# EAGLE schematic alt_rpd_schematic (EAGLE 9.7.0)
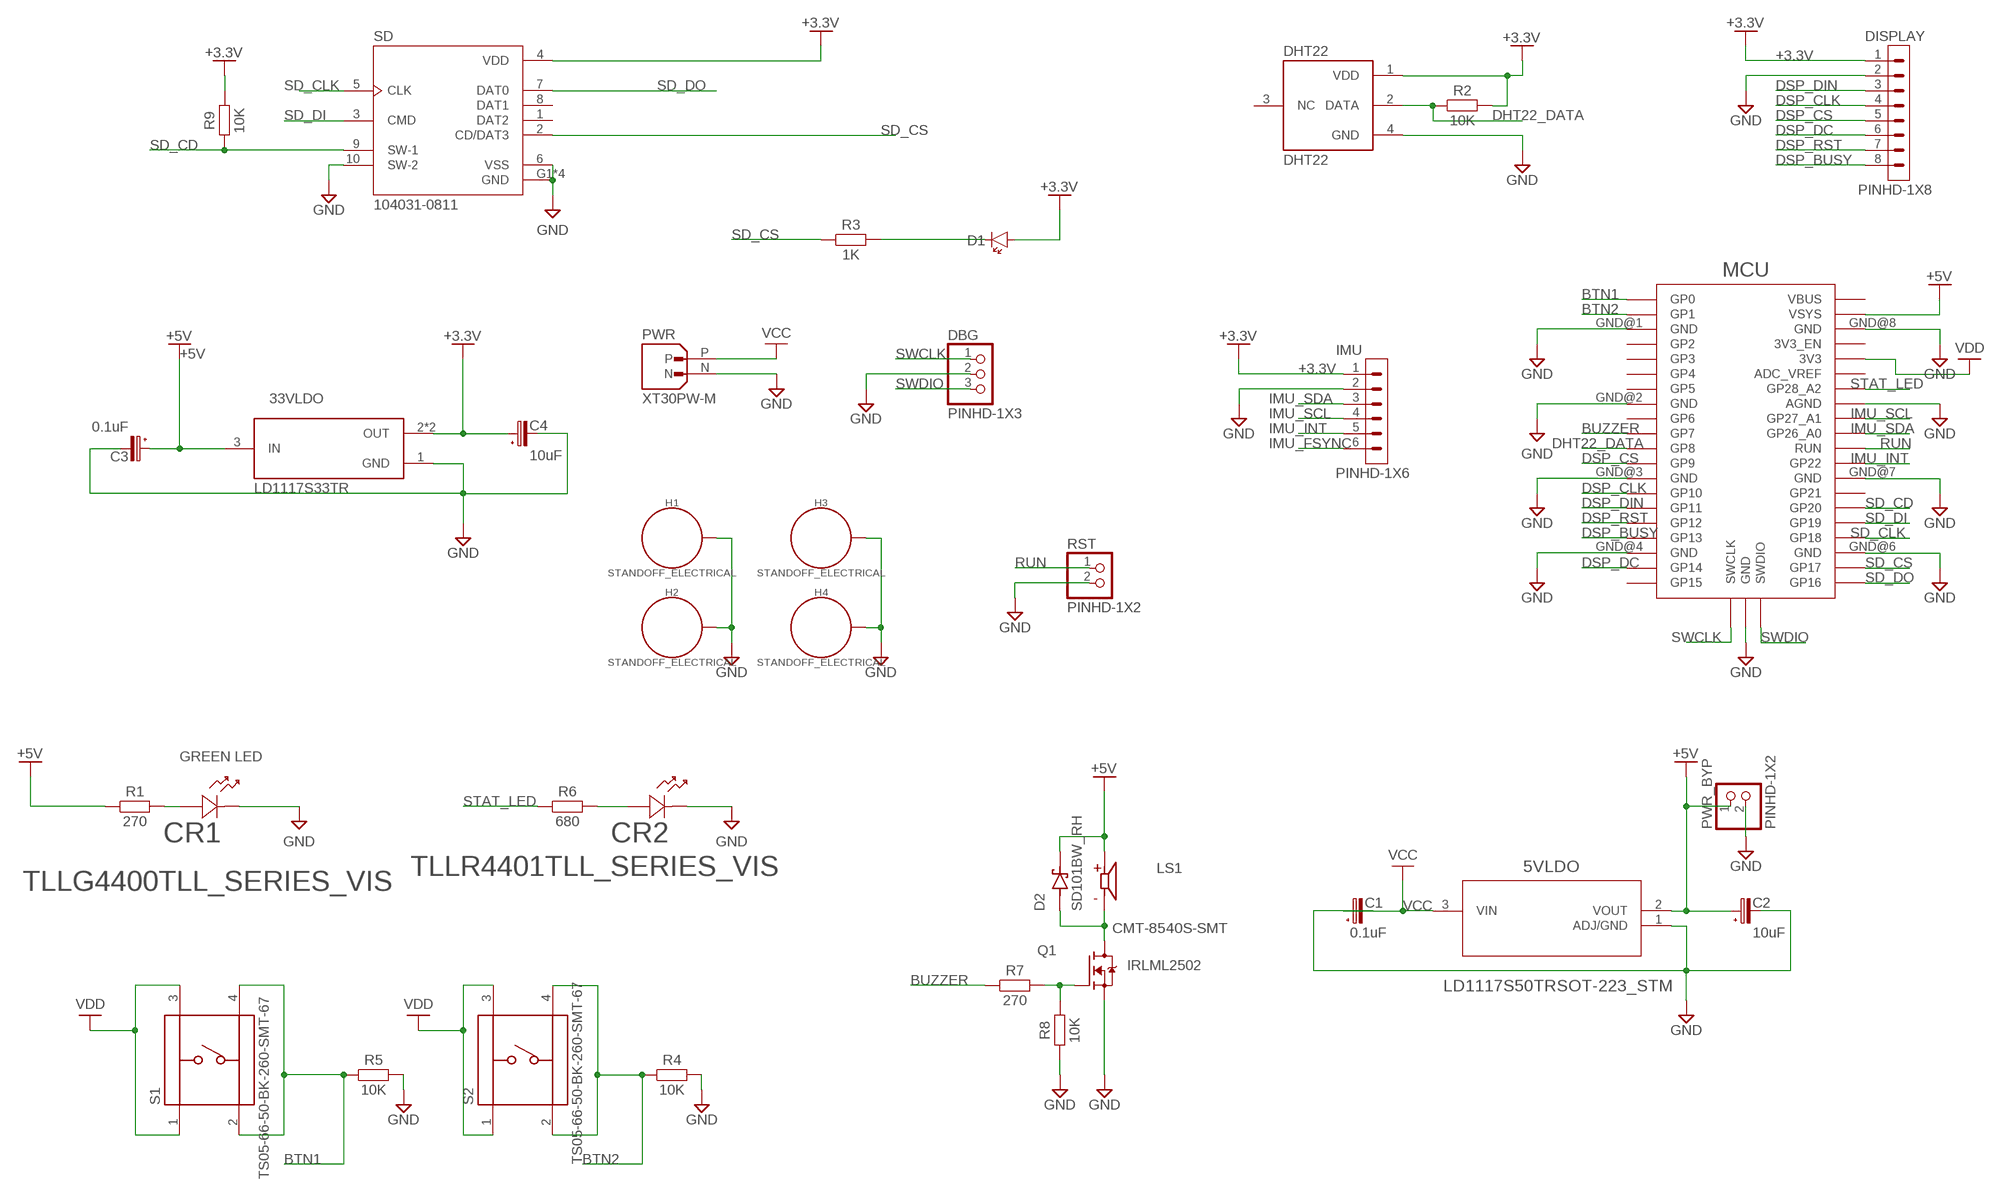
[diagram p0: schematic, sheet 1]

## Parts
5VLDO  LD1117S50TRSOT-223_STM  [SOT-223_STM]
33VLDO  LD1117S33TR  [SOT230P700X180-4N]
C1  0.1uF  C-POL_TANTALUM-1206(3216-METRIC)  [CAPMP3216X180N]
C2  10uF  C-POL_TANTALUM-1206(3216-METRIC)  [CAPMP3216X180N]
C3  0.1uF  C-POL_TANTALUM-1206(3216-METRIC)  [CAPMP3216X180N]
C4  10uF  C-POL_TANTALUM-1206(3216-METRIC)  [CAPMP3216X180N]
CR1  TLLG4400TLL_SERIES_VIS  [TLL_SERIES_VIS]
CR2  TLLR4401TLL_SERIES_VIS  [TLL_SERIES_VIS]
D1  LED_RED  CHIP-FLAT-R_0805  [LEDC2012X110N_FLAT-R]
D2  SD101BW_RH  [DIO_SD101BW_RH]
DBG  PINHD-1X3  [1X03]
DHT22  DHT22  [XDCR_DHT22]
DISPLAY  PINHD-1X8  [1X08]
H1  STANDOFF_ELECTRICAL  [STANDOFF-ELECTRICAL]
H2  STANDOFF_ELECTRICAL  [STANDOFF-ELECTRICAL]
H3  STANDOFF_ELECTRICAL  [STANDOFF-ELECTRICAL]
H4  STANDOFF_ELECTRICAL  [STANDOFF-ELECTRICAL]
IMU  PINHD-1X6  [1X06]
LS1  CMT-8540S-SMT  [CUI_CMT-8540S-SMT]
MCU  RPI_PICO_IG-SMD  [RPI_PICO]
PWR  XT30PW-M  [AMASS_XT30PW-M]
PWR_BYP  PINHD-1X2  [1X02]
Q1  IRLML2502  [SOT95P237X112-3N]
R1  270  R_CHIP-1210(3225-METRIC)  [RESC3224X71]
R2  10K  R_CHIP-1206(3216-METRIC)  [RESC3216X70]
R3  1K  R_CHIP-1206(3216-METRIC)  [RESC3216X70]
R4  10K  R_CHIP-1206(3216-METRIC)  [RESC3216X70]
R5  10K  R_CHIP-1206(3216-METRIC)  [RESC3216X70]
R6  680  R_CHIP-1210(3225-METRIC)  [RESC3224X71]
R7  270  R_CHIP-1210(3225-METRIC)  [RESC3224X71]
R8  10K  R_CHIP-1206(3216-METRIC)  [RESC3216X70]
R9  10K  R_CHIP-1206(3216-METRIC)  [RESC3216X70]
RST  PINHD-1X2  [1X02]
S1  TS05-66-50-BK-260-SMT-67  [SW_TS05-66-50-BK-260-SMT-67]
S2  TS05-66-50-BK-260-SMT-67  [SW_TS05-66-50-BK-260-SMT-67]
SD  104031-0811  [MOLEX_104031-0811]

## Nets
+3.3V [Power]: 33VLDO.2(OUT) 33VLDO.4(OUT) C4.1(+) D1.A DHT22.1(VDD) DISPLAY.1 IMU.1 R2.2 R9.2 SD.4(VDD)
+5V [Power]: 5VLDO.2(VOUT) 33VLDO.3(IN) C2.1(+) C3.1(+) D2.C(K) LS1.P MCU.VSYS PWR_BYP.1 R1.1
BTN1: MCU.GP0 R5.1 S1.2 S1.4
BTN2: MCU.GP1 R4.1 S2.2 S2.4
BUZZER: MCU.GP7 R7.1
DHT22_DATA: DHT22.2(DATA) MCU.GP8 R2.1
DSP_BUSY: DISPLAY.8 MCU.GP13
DSP_CLK: DISPLAY.4 MCU.GP10
DSP_CS: DISPLAY.5 MCU.GP9
DSP_DC: DISPLAY.6 MCU.GP14
DSP_DIN: DISPLAY.3 MCU.GP11
DSP_RST: DISPLAY.7 MCU.GP12
GND [Power]: 5VLDO.1(ADJ/GND) 33VLDO.1(GND) C1.2(-) C2.2(-) C3.2(-) C4.2(-) CR1.1 CR2.1 DBG.2 DHT22.4(GND) DISPLAY.2 H1.P1 H2.P1 H3.P1 H4.P1 IMU.2 MCU.AGND MCU.GND@1(GND) MCU.GND@2(GND) MCU.GND@3(GND) MCU.GND@4(GND) MCU.GND@5(GND) MCU.GND@6(GND) MCU.GND@7(GND) MCU.GND@8(GND) PWR.N PWR_BYP.2 Q1.2(S) R4.2 R5.2 R8.1 RST.2 SD.6(VSS) SD.10(SW-2) SD.G1(GND) SD.G2(GND) SD.G3(GND) SD.G4(GND)
IMU_FSYNC: IMU.6
IMU_INT: IMU.5 MCU.GP22
IMU_SCL: IMU.4 MCU.GP27_A1
IMU_SDA: IMU.3 MCU.GP26_A0
N$1: CR2.2 R6.2
N$2: CR1.2 R1.2
N$3: D2.A LS1.N Q1.3(D)
N$4: Q1.1(G) R7.2 R8.2
N$7: D1.C R3.2
RUN: MCU.RUN RST.1
SD_CD: MCU.GP20 R9.1 SD.9(SW-1)
SD_CLK: MCU.GP18 SD.5(CLK)
SD_CS: MCU.GP17 R3.1 SD.2(CD/DAT3)
SD_DI: MCU.GP19 SD.3(CMD)
SD_DO: MCU.GP16 SD.7(DAT0)
STAT_LED: MCU.GP28_A2 R6.1
SWCLK: DBG.1 MCU.SWCLK
SWDIO: DBG.3 MCU.SWDIO
VCC [Power]: 5VLDO.3(VIN) C1.1(+) PWR.P
VDD [Power]: MCU.3V3 S1.1 S1.3 S2.1 S2.3
Unconnected: DHT22.3(NC) MCU.3V3_EN MCU.ADC_VREF MCU.GP2 MCU.GP3 MCU.GP4 MCU.GP5 MCU.GP6 MCU.GP15 MCU.GP21 MCU.VBUS SD.1(DAT2) SD.8(DAT1)

## Library data of the parts
5VLDO = ukseds electronics:LD1117S50TR; COPYRIGHT: Copyright (C) 2026 Ultra Librarian. All rights reserved.; DATASHEET: https://www.st.com/resource/en/datasheet/ld1117.pdf; DESCRIPTION: Adjustable and fixed low drop positive voltage regulator; MANUFACTURER_NAME: STMicroelectronics; MANUFACTURER_PART_NUMBER: LD1117S50TR
33VLDO = ukseds electronics:LD1117S33TR; MANUFACTURER: ST Microelectronics
C1-C4 = Capacitor:C-POL: Capacitor Polarised - Generic; CATEGORY: Capacitor; PACKAGE_SIZE: 1206; PACKAGE_TYPE: Surface Mount; SUBCATEGORY: Tantalum Capacitors; TYPE: Polymer Capacitors
CR1 = ukseds electronics:TLLG4400; COPYRIGHT: Copyright (C) 2026 Ultra Librarian. All rights reserved.; DATASHEET: https://www.vishay.com/doc?83029; DESCRIPTION: GREEN LED; MANUFACTURER_NAME: Vishay; MANUFACTURER_PART_NUMBER: TLLG4400
CR2 = ukseds electronics:TLLR4401; COPYRIGHT: Copyright (C) 2026 Ultra Librarian. All rights reserved.; DATASHEET: https://www.vishay.com/doc?83029; DESCRIPTION: 3MM LED RED LC TINT. DIFF-e3; MANUFACTURER_NAME: Vishay; MANUFACTURER_PART_NUMBER: TLLR4401
D1 = LED:CHIP-FLAT-R: Red LED - Generic; CATEGORY: LED; COLOR: Red; DESCRIPTION: Red LED Indication 0805 (2012 Metric); PACKAGE_SIZE: 0805; PACKAGE_TYPE: Surface Mount; SUBCATEGORY: Chip LED; TYPE: Square with Flat Top
D2 = ukseds electronics:SD101BW_RH: Check availability <https://pricing.snapeda.com/parts/BAT46GW%20RHG/Taiwan%20Semiconductor/view-part?ref=eda>; AVAILABILITY: In Stock; DESCRIPTION: 0.25A, 100V, Schottky Rectifier; MF: Taiwan Semiconductor; MP: BAT46GW RHG; PACKAGE: SOD-123-2 Taiwan Semiconductor; PRICE: None
DBG = Connector:PINHD-1X3: PIN HEADER; CATEGORY: Headers; DESCRIPTION: Header-Straight-3 Position; PACKAGE_TYPE: THT; PITCH: 0.100" (2.54mm); SUBCATEGORY: Headers-Male Pins; TYPE: Board to Board or Cable-Unshrouded-Through Hole-Straight
DHT22 = ukseds electronics:DHT22; CREATOR: KARTHIK; MANUFACTURER: Aosong Electronics; MAXIMUM_PACKAGE_HEIGHT: 7.8 mm; STANDARD: IPC-7351B
DISPLAY = Connector:PINHD-1X8: Pin Header; CATEGORY: Connectors; DESCRIPTION: Header-Straight-8 Position; PACKAGE_TYPE: Through Hole; PITCH: 0.100" (2.54mm); SUBCATEGORY: Headers; TYPE: Male Pins
H1-H4 = SparkFun-Hardware:STANDOFF_ELECTRICAL: Stand Off Drill holes with an electrical connection. For example, use these to ground your board to a chassis. Example SparkFun Products Screw - Phillips Head (1/4", 4-40, 10 pack) <https://www.sparkfun.com/products/10453> (PRT-10453) Screw - Phillips Head (1/2", 4-40, 10 pack) <https://www.sparkfun.com/products/10452> (PRT-10452) Screw - Phillips Head (3/4", 4-40, 10 pack) <https://www.sparkfun.com/products/10451> (PRT-10451) Screw - Phillips Head (1", 4-40, 10 pack) <https://www.sparkfun.com/products/10450> (PRT-10450)
IMU = Connector:PINHD-1X6: Pin Header; CATEGORY: Connectors; DESCRIPTION: Header-Straight-6 Position; PACKAGE_TYPE: Through Hole; PITCH: 0.100" (2.54mm); SUBCATEGORY: Headers; TYPE: Male Pins
LS1 = ukseds electronics:CMT-8540S-SMT; AVAILABILITY: Unavailable; DESCRIPTION: 8.5 mm, 5.0 Vo-p, 100 dB, Surface Mount _SMT_, Magnetic Audio Transducer Buzzer; MF: CUI; MP: CMT-8540S-SMT; PACKAGE: None; PRICE: None
MCU = ukseds electronics:RPI_PICO_IG
PWR = ukseds electronics:XT30PW-M; MANUFACTURER: Amass; MAXIMUM_PACKAGE_HEIGHT: 5 mm; PARTREV: 1.2; SNAPEDA_PN: XT30PW-M; STANDARD: Manufacturer Recommendations
PWR_BYP RST = Connector:PINHD-1X2: PIN HEADER; CATEGORY: Headers; DESCRIPTION: Header-Straight-2 Position; PACKAGE_TYPE: THT; PITCH: 0.100" (2.54mm); SUBCATEGORY: Headers-Male Pins; TYPE: Board to Board or Cable-Unshrouded-Through Hole-Straight
Q1 = ukseds electronics:IRLML2502; MANUFACTURER: Infineon Technologies; MAXIMUM_PACKAGE_HEIGHT: 1.12 mm; PARTREV: April 24, 2014; SNAPEDA_PACKAGE_ID: 11907; SNAPEDA_PN: IRLML2502; STANDARD: IPC 7351B
R1 R6 R7 = Resistor:R: Resistor Fixed - Generic; CATEGORY: Resistors; DESCRIPTION: Chip Resistor 3.20 X 2.49 X 0.71 mm body 1210(3225-METRIC) Package; PACKAGE_SIZE: 1210; PACKAGE_TYPE: Surface Mount
R2-R5 R8 R9 = Resistor:R: Resistor Fixed - Generic; CATEGORY: Resistors; DESCRIPTION: Chip Resistor 3.20 X 1.60 X 0.70 mm body 1206(3216-METRIC) Package; PACKAGE_SIZE: 1206; PACKAGE_TYPE: Surface Mount
S1 S2 = ukseds electronics:TS05-66-50-BK-260-SMT-67; MANUFACTURER: CUI Devices; PARTREV: 1.0; STANDARD: Manufacturer Recommendations
SD = ukseds electronics:104031-0811; MANUFACTURER: Molex; MAXIMUM_PACKAGE_HEIGHT: 1.57mm; PARTREV: B2; STANDARD: Manufacturer Recommendations

## Net classes
1 Power: width 0.635 mm